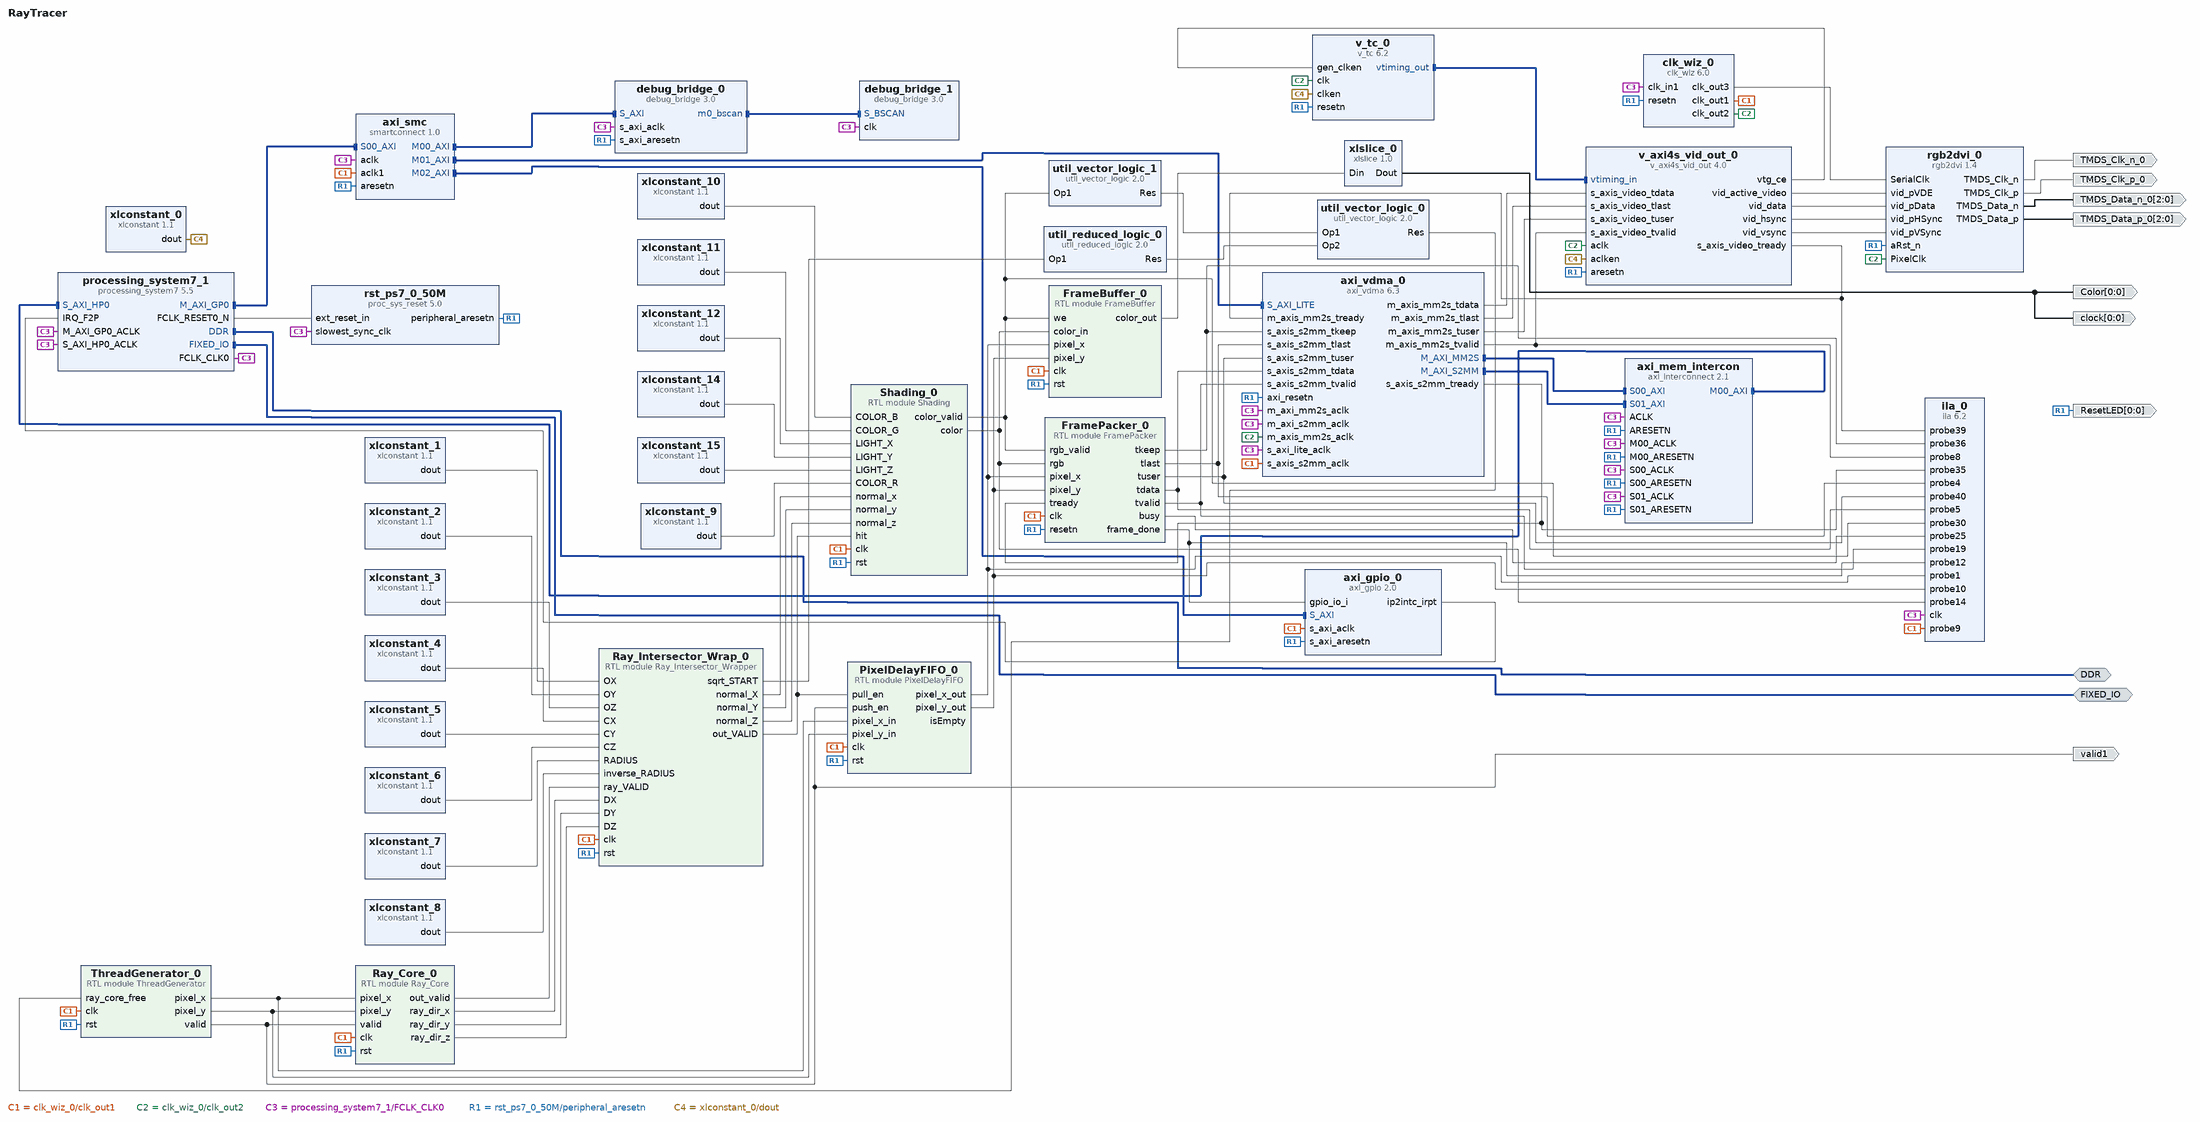
[diagram p0: block diagram of the top level]
# Vivado block design RayTracer, xc7z020clg400-1, Vivado 2024.2
create_bd_design RayTracer

create_bd_intf_port -mode Master -vlnv xilinx.com:interface:ddrx_rtl:1.0 DDR
create_bd_intf_port -mode Master -vlnv xilinx.com:display_processing_system7:fixedio_rtl:1.0 FIXED_IO
create_bd_port -dir O -from 0 -to 0 -type data Color
create_bd_port -dir O -from 0 -to 0 -type rst ResetLED
create_bd_port -dir O -type clk TMDS_Clk_n_0
create_bd_port -dir O -type clk TMDS_Clk_p_0
create_bd_port -dir O -from 2 -to 0 TMDS_Data_n_0
create_bd_port -dir O -from 2 -to 0 TMDS_Data_p_0
create_bd_port -dir O -from 0 -to 0 -type clk clock
create_bd_port -dir O valid1

create_bd_cell -type module -reference FrameBuffer FrameBuffer_0
create_bd_cell -type module -reference PixelDelayFIFO PixelDelayFIFO_0
create_bd_cell -type module -reference Ray_Core Ray_Core_0
create_bd_cell -type module -reference Ray_Intersector_Wrapper Ray_Intersector_Wrap_0
create_bd_cell -type module -reference Shading Shading_0
create_bd_cell -type module -reference ThreadGenerator ThreadGenerator_0
create_bd_cell -type ip -vlnv xilinx.com:ip:axi_interconnect:2.1 axi_mem_intercon
set_property -dict {CONFIG.NUM_MI 1 CONFIG.NUM_SI 2} [get_bd_cells axi_mem_intercon]
create_bd_cell -type ip -vlnv xilinx.com:ip:smartconnect:1.0 axi_smc
set_property -dict {CONFIG.NUM_CLKS 2 CONFIG.NUM_MI 3 CONFIG.NUM_SI 1} [get_bd_cells axi_smc]
create_bd_cell -type ip -vlnv xilinx.com:ip:axi_vdma:6.3 axi_vdma_0
set_property -dict {CONFIG.c_addr_width 32 CONFIG.c_num_fstores 1 CONFIG.c_use_mm2s_fsync 0} [get_bd_cells axi_vdma_0]
create_bd_cell -type ip -vlnv xilinx.com:ip:clk_wiz:6.0 clk_wiz_0
set_property -dict [list \
  CONFIG.CLKIN1_JITTER_PS 80.0 \
  CONFIG.CLKIN2_JITTER_PS 100.0 \
  CONFIG.CLKOUT1_JITTER 324.139 \
  CONFIG.CLKOUT1_PHASE_ERROR 251.929 \
  CONFIG.CLKOUT1_REQUESTED_OUT_FREQ 25.000 \
  CONFIG.CLKOUT2_JITTER 323.721 \
  CONFIG.CLKOUT2_PHASE_ERROR 251.929 \
  CONFIG.CLKOUT2_REQUESTED_OUT_FREQ 25.175 \
  CONFIG.CLKOUT2_USED true \
  CONFIG.CLKOUT3_JITTER 231.295 \
  CONFIG.CLKOUT3_PHASE_ERROR 251.929 \
  CONFIG.CLKOUT3_REQUESTED_OUT_FREQ 125.875 \
  CONFIG.CLKOUT3_USED true \
  CONFIG.CLK_IN1_BOARD_INTERFACE sys_clock \
  CONFIG.MMCM_CLKFBOUT_MULT_F 35.250 \
  CONFIG.MMCM_CLKIN1_PERIOD 8.000 \
  CONFIG.MMCM_CLKIN2_PERIOD 10.000 \
  CONFIG.MMCM_CLKOUT0_DIVIDE_F 35.250 \
  CONFIG.MMCM_CLKOUT1_DIVIDE 35 \
  CONFIG.MMCM_CLKOUT2_DIVIDE 7 \
  CONFIG.MMCM_DIVCLK_DIVIDE 5 \
  CONFIG.NUM_OUT_CLKS 3 \
  CONFIG.RESET_PORT resetn \
  CONFIG.RESET_TYPE ACTIVE_LOW \
  CONFIG.SECONDARY_SOURCE Single_ended_clock_capable_pin \
  CONFIG.USE_INCLK_SWITCHOVER false \
] [get_bd_cells clk_wiz_0]
create_bd_cell -type ip -vlnv xilinx.com:ip:debug_bridge:3.0 debug_bridge_0
set_property -dict {CONFIG.C_DEBUG_MODE 2 CONFIG.C_NUM_BS_MASTER 1} [get_bd_cells debug_bridge_0]
create_bd_cell -type ip -vlnv xilinx.com:ip:debug_bridge:3.0 debug_bridge_1
set_property -dict {CONFIG.C_ENABLE_CLK_DIVIDER false CONFIG.C_NUM_BS_MASTER 0} [get_bd_cells debug_bridge_1]
create_bd_cell -type ip -vlnv xilinx.com:ip:ila:6.2 ila_0
create_bd_cell -type ip -vlnv xilinx.com:ip:processing_system7:5.5 processing_system7_1
set_property -dict [list \
  CONFIG.PCW_APU_PERIPHERAL_FREQMHZ 666.666666 \
  CONFIG.PCW_ENET0_PERIPHERAL_ENABLE 0 \
  CONFIG.PCW_FPGA0_PERIPHERAL_FREQMHZ 50 \
  CONFIG.PCW_FPGA1_PERIPHERAL_FREQMHZ 50 \
  CONFIG.PCW_GPIO_MIO_GPIO_ENABLE 0 \
  CONFIG.PCW_IRQ_F2P_INTR 1 \
  CONFIG.PCW_PERIPHERAL_BOARD_PRESET part0 \
  CONFIG.PCW_PRESET_BANK1_VOLTAGE {LVCMOS 3.3V} \
  CONFIG.PCW_QSPI_PERIPHERAL_ENABLE 0 \
  CONFIG.PCW_SD0_PERIPHERAL_ENABLE 0 \
  CONFIG.PCW_UART1_PERIPHERAL_ENABLE 0 \
  CONFIG.PCW_UIPARAM_DDR_FREQ_MHZ 533.333333 \
  CONFIG.PCW_UIPARAM_DDR_PARTNO {MT41J128M8 JP-125} \
  CONFIG.PCW_USB0_PERIPHERAL_ENABLE 0 \
  CONFIG.PCW_USE_FABRIC_INTERRUPT 1 \
  CONFIG.PCW_USE_S_AXI_HP0 1 \
] [get_bd_cells processing_system7_1]
# 329 more settings of processing_system7_1 are not shown: defaults, MIO pin electricals, DDR timing, and values the tool derives
create_bd_cell -type ip -vlnv xilinx.com:ip:proc_sys_reset:5.0 rst_ps7_0_50M
create_bd_cell -type ip -vlnv xilinx.com:ip:util_reduced_logic:2.0 util_reduced_logic_0
set_property -dict {CONFIG.C_SIZE 5} [get_bd_cells util_reduced_logic_0]
create_bd_cell -type ip -vlnv xilinx.com:ip:util_vector_logic:2.0 util_vector_logic_0
set_property -dict {CONFIG.C_SIZE 1} [get_bd_cells util_vector_logic_0]
create_bd_cell -type ip -vlnv xilinx.com:ip:util_vector_logic:2.0 util_vector_logic_1
set_property -dict {CONFIG.C_OPERATION not CONFIG.C_SIZE 1} [get_bd_cells util_vector_logic_1]
create_bd_cell -type ip -vlnv xilinx.com:ip:v_axi4s_vid_out:4.0 v_axi4s_vid_out_0
create_bd_cell -type ip -vlnv xilinx.com:ip:v_tc:6.2 v_tc_0
set_property -dict {CONFIG.HAS_AXI4_LITE false CONFIG.HAS_INTC_IF false} [get_bd_cells v_tc_0]
create_bd_cell -type ip -vlnv xilinx.com:ip:xlconstant:1.1 xlconstant_0
create_bd_cell -type ip -vlnv xilinx.com:ip:xlconstant:1.1 xlconstant_1
set_property -dict {CONFIG.CONST_VAL 0 CONFIG.CONST_WIDTH 32} [get_bd_cells xlconstant_1]
create_bd_cell -type ip -vlnv xilinx.com:ip:xlconstant:1.1 xlconstant_10
set_property -dict {CONFIG.CONST_VAL 240 CONFIG.CONST_WIDTH 8} [get_bd_cells xlconstant_10]
create_bd_cell -type ip -vlnv xilinx.com:ip:xlconstant:1.1 xlconstant_11
set_property -dict {CONFIG.CONST_VAL 146 CONFIG.CONST_WIDTH 8} [get_bd_cells xlconstant_11]
create_bd_cell -type ip -vlnv xilinx.com:ip:xlconstant:1.1 xlconstant_12
set_property -dict {CONFIG.CONST_VAL 8192 CONFIG.CONST_WIDTH 32} [get_bd_cells xlconstant_12]
create_bd_cell -type ip -vlnv xilinx.com:ip:xlconstant:1.1 xlconstant_14
set_property -dict {CONFIG.CONST_VAL 8192 CONFIG.CONST_WIDTH 32} [get_bd_cells xlconstant_14]
create_bd_cell -type ip -vlnv xilinx.com:ip:xlconstant:1.1 xlconstant_15
set_property -dict {CONFIG.CONST_VAL 8192 CONFIG.CONST_WIDTH 32} [get_bd_cells xlconstant_15]
create_bd_cell -type ip -vlnv xilinx.com:ip:xlconstant:1.1 xlconstant_2
set_property -dict {CONFIG.CONST_VAL 0 CONFIG.CONST_WIDTH 32} [get_bd_cells xlconstant_2]
create_bd_cell -type ip -vlnv xilinx.com:ip:xlconstant:1.1 xlconstant_3
set_property -dict {CONFIG.CONST_VAL 0 CONFIG.CONST_WIDTH 32} [get_bd_cells xlconstant_3]
create_bd_cell -type ip -vlnv xilinx.com:ip:xlconstant:1.1 xlconstant_4
set_property -dict {CONFIG.CONST_VAL 0 CONFIG.CONST_WIDTH 32} [get_bd_cells xlconstant_4]
create_bd_cell -type ip -vlnv xilinx.com:ip:xlconstant:1.1 xlconstant_5
set_property -dict {CONFIG.CONST_VAL 0 CONFIG.CONST_WIDTH 32} [get_bd_cells xlconstant_5]
create_bd_cell -type ip -vlnv xilinx.com:ip:xlconstant:1.1 xlconstant_6
set_property -dict {CONFIG.CONST_VAL -1024 CONFIG.CONST_WIDTH 32} [get_bd_cells xlconstant_6]
create_bd_cell -type ip -vlnv xilinx.com:ip:xlconstant:1.1 xlconstant_7
set_property -dict {CONFIG.CONST_VAL 2048 CONFIG.CONST_WIDTH 31} [get_bd_cells xlconstant_7]
create_bd_cell -type ip -vlnv xilinx.com:ip:xlconstant:1.1 xlconstant_8
set_property -dict {CONFIG.CONST_VAL 131072 CONFIG.CONST_WIDTH 32} [get_bd_cells xlconstant_8]
create_bd_cell -type ip -vlnv xilinx.com:ip:xlconstant:1.1 xlconstant_9
set_property -dict {CONFIG.CONST_VAL 73 CONFIG.CONST_WIDTH 8} [get_bd_cells xlconstant_9]
create_bd_cell -type ip -vlnv xilinx.com:ip:xlslice:1.0 xlslice_0
set_property -dict {CONFIG.DIN_FROM 21 CONFIG.DIN_TO 21 CONFIG.DIN_WIDTH 24} [get_bd_cells xlslice_0]
create_bd_cell -type ip -vlnv xilinx.com:ip:axi_gpio:2.0 axi_gpio_0
set_property -dict [list \
  CONFIG.C_ALL_INPUTS 1 \
  CONFIG.C_GPIO_WIDTH 1 \
  CONFIG.C_INTERRUPT_PRESENT 1 \
  CONFIG.C_IS_DUAL 0 \
] [get_bd_cells axi_gpio_0]
create_bd_cell -type module -reference FramePacker FramePacker_0
create_bd_cell -type ip -vlnv digilentinc.com:ip:rgb2dvi:1.4 rgb2dvi_0
set_property -dict {CONFIG.kGenerateSerialClk false CONFIG.kRstActiveHigh false} [get_bd_cells rgb2dvi_0]

# ---- connections ----

connect_bd_intf_net [get_bd_intf_pins axi_mem_intercon/M00_AXI] [get_bd_intf_pins processing_system7_1/S_AXI_HP0]
connect_bd_intf_net [get_bd_intf_pins debug_bridge_0/S_AXI] [get_bd_intf_pins axi_smc/M00_AXI]
connect_bd_intf_net [get_bd_intf_pins axi_smc/M01_AXI] [get_bd_intf_pins axi_vdma_0/S_AXI_LITE]
connect_bd_intf_net [get_bd_intf_pins axi_smc/M02_AXI] [get_bd_intf_pins axi_gpio_0/S_AXI]
connect_bd_intf_net [get_bd_intf_pins axi_vdma_0/M_AXI_MM2S] [get_bd_intf_pins axi_mem_intercon/S00_AXI]
connect_bd_intf_net [get_bd_intf_pins axi_vdma_0/M_AXI_S2MM] [get_bd_intf_pins axi_mem_intercon/S01_AXI]
connect_bd_intf_net [get_bd_intf_pins debug_bridge_1/S_BSCAN] [get_bd_intf_pins debug_bridge_0/m0_bscan]
connect_bd_intf_net -intf_net processing_system7_0_M_AXI_GP0 [get_bd_intf_pins processing_system7_1/M_AXI_GP0] [get_bd_intf_pins axi_smc/S00_AXI]
connect_bd_intf_net [get_bd_intf_ports DDR] [get_bd_intf_pins processing_system7_1/DDR]
connect_bd_intf_net [get_bd_intf_ports FIXED_IO] [get_bd_intf_pins processing_system7_1/FIXED_IO]
connect_bd_intf_net [get_bd_intf_pins v_tc_0/vtiming_out] [get_bd_intf_pins v_axi4s_vid_out_0/vtiming_in]
connect_bd_net [get_bd_pins FrameBuffer_0/color_out] [get_bd_pins xlslice_0/Din]
connect_bd_net [get_bd_pins FramePacker_0/busy] [get_bd_pins ila_0/probe25]
connect_bd_net [get_bd_pins FramePacker_0/frame_done] [get_bd_pins axi_gpio_0/gpio_io_i] [get_bd_pins ila_0/probe12]
connect_bd_net [get_bd_pins FramePacker_0/tkeep] [get_bd_pins axi_vdma_0/s_axis_s2mm_tkeep] [get_bd_pins ila_0/probe36]
connect_bd_net [get_bd_pins FramePacker_0/tlast] [get_bd_pins axi_vdma_0/s_axis_s2mm_tlast] [get_bd_pins ila_0/probe4]
connect_bd_net [get_bd_pins FramePacker_0/tuser] [get_bd_pins axi_vdma_0/s_axis_s2mm_tuser] [get_bd_pins ila_0/probe40]
# net PixelDelayFIFO_0_isEmpty has one end: PixelDelayFIFO_0/isEmpty
connect_bd_net [get_bd_pins PixelDelayFIFO_0/pixel_x_out] \
  [get_bd_pins ila_0/probe1] [get_bd_pins FrameBuffer_0/pixel_x] [get_bd_pins FramePacker_0/pixel_x]
connect_bd_net [get_bd_pins PixelDelayFIFO_0/pixel_y_out] \
  [get_bd_pins ila_0/probe10] [get_bd_pins FrameBuffer_0/pixel_y] [get_bd_pins FramePacker_0/pixel_y]
connect_bd_net [get_bd_pins Ray_Core_0/out_valid] [get_bd_pins Ray_Intersector_Wrap_0/ray_VALID]
connect_bd_net [get_bd_pins Ray_Core_0/ray_dir_x] [get_bd_pins Ray_Intersector_Wrap_0/DX]
connect_bd_net [get_bd_pins Ray_Core_0/ray_dir_y] [get_bd_pins Ray_Intersector_Wrap_0/DY]
connect_bd_net [get_bd_pins Ray_Core_0/ray_dir_z] [get_bd_pins Ray_Intersector_Wrap_0/DZ]
connect_bd_net [get_bd_pins Ray_Intersector_Wrap_0/normal_X] [get_bd_pins Shading_0/normal_x]
connect_bd_net [get_bd_pins Ray_Intersector_Wrap_0/normal_Y] [get_bd_pins Shading_0/normal_y]
connect_bd_net [get_bd_pins Ray_Intersector_Wrap_0/normal_Z] [get_bd_pins Shading_0/normal_z]
connect_bd_net [get_bd_pins Ray_Intersector_Wrap_0/out_VALID] [get_bd_pins PixelDelayFIFO_0/pull_en] [get_bd_pins Shading_0/hit]
connect_bd_net [get_bd_pins Ray_Intersector_Wrap_0/sqrt_START] [get_bd_pins util_reduced_logic_0/Op1]
connect_bd_net [get_bd_pins Shading_0/color] [get_bd_pins ila_0/probe14] [get_bd_pins FrameBuffer_0/color_in] [get_bd_pins FramePacker_0/rgb]
connect_bd_net [get_bd_pins Shading_0/color_valid] \
  [get_bd_pins util_vector_logic_1/Op1] [get_bd_pins ila_0/probe30] [get_bd_pins FrameBuffer_0/we] \
  [get_bd_pins FramePacker_0/rgb_valid]
connect_bd_net [get_bd_pins ThreadGenerator_0/pixel_x] [get_bd_pins PixelDelayFIFO_0/pixel_x_in] [get_bd_pins Ray_Core_0/pixel_x]
connect_bd_net [get_bd_pins ThreadGenerator_0/pixel_y] [get_bd_pins PixelDelayFIFO_0/pixel_y_in] [get_bd_pins Ray_Core_0/pixel_y]
connect_bd_net [get_bd_pins ThreadGenerator_0/valid] [get_bd_ports valid1] [get_bd_pins PixelDelayFIFO_0/push_en] [get_bd_pins Ray_Core_0/valid]
connect_bd_net [get_bd_pins axi_gpio_0/ip2intc_irpt] [get_bd_pins processing_system7_1/IRQ_F2P]
connect_bd_net [get_bd_pins axi_vdma_0/m_axis_mm2s_tdata] [get_bd_pins v_axi4s_vid_out_0/s_axis_video_tdata]
connect_bd_net [get_bd_pins axi_vdma_0/m_axis_mm2s_tlast] [get_bd_pins v_axi4s_vid_out_0/s_axis_video_tlast]
connect_bd_net [get_bd_pins axi_vdma_0/m_axis_mm2s_tuser] [get_bd_pins v_axi4s_vid_out_0/s_axis_video_tuser]
connect_bd_net [get_bd_pins axi_vdma_0/m_axis_mm2s_tvalid] [get_bd_pins ila_0/probe8] [get_bd_pins v_axi4s_vid_out_0/s_axis_video_tvalid]
connect_bd_net [get_bd_pins axi_vdma_0/s_axis_s2mm_tready] [get_bd_pins ila_0/probe35] [get_bd_pins FramePacker_0/tready]
connect_bd_net [get_bd_pins clk_wiz_0/clk_out1] \
  [get_bd_pins ila_0/probe9] [get_bd_pins axi_vdma_0/s_axis_s2mm_aclk] [get_bd_pins axi_gpio_0/s_axi_aclk] \
  [get_bd_pins axi_smc/aclk1] [get_bd_pins FrameBuffer_0/clk] [get_bd_pins PixelDelayFIFO_0/clk] [get_bd_pins Ray_Core_0/clk] \
  [get_bd_pins Shading_0/clk] [get_bd_pins ThreadGenerator_0/clk] [get_bd_pins Ray_Intersector_Wrap_0/clk] \
  [get_bd_pins FramePacker_0/clk]
connect_bd_net [get_bd_pins clk_wiz_0/clk_out2] \
  [get_bd_pins v_tc_0/clk] [get_bd_pins v_axi4s_vid_out_0/aclk] [get_bd_pins axi_vdma_0/m_axis_mm2s_aclk] \
  [get_bd_pins rgb2dvi_0/PixelClk]
connect_bd_net [get_bd_pins clk_wiz_0/clk_out3] [get_bd_pins rgb2dvi_0/SerialClk]
connect_bd_net -net framPacker_0_tdata [get_bd_pins FramePacker_0/tdata] [get_bd_pins axi_vdma_0/s_axis_s2mm_tdata] [get_bd_pins ila_0/probe5]
connect_bd_net -net framPacker_0_tvalid [get_bd_pins FramePacker_0/tvalid] [get_bd_pins axi_vdma_0/s_axis_s2mm_tvalid] [get_bd_pins ila_0/probe19]
connect_bd_net -net processing_system7_0_FCLK_CLK1 [get_bd_pins processing_system7_1/FCLK_CLK0] \
  [get_bd_pins processing_system7_1/M_AXI_GP0_ACLK] [get_bd_pins axi_smc/aclk] [get_bd_pins rst_ps7_0_50M/slowest_sync_clk] \
  [get_bd_pins clk_wiz_0/clk_in1] [get_bd_pins ila_0/clk] [get_bd_pins debug_bridge_0/s_axi_aclk] \
  [get_bd_pins debug_bridge_1/clk] [get_bd_pins axi_vdma_0/s_axi_lite_aclk] [get_bd_pins axi_vdma_0/m_axi_mm2s_aclk] \
  [get_bd_pins axi_mem_intercon/S00_ACLK] [get_bd_pins processing_system7_1/S_AXI_HP0_ACLK] \
  [get_bd_pins axi_mem_intercon/M00_ACLK] [get_bd_pins axi_mem_intercon/ACLK] [get_bd_pins axi_vdma_0/m_axi_s2mm_aclk] \
  [get_bd_pins axi_mem_intercon/S01_ACLK]
connect_bd_net -net processing_system7_0_FCLK_RESET0_N1 [get_bd_pins processing_system7_1/FCLK_RESET0_N] [get_bd_pins rst_ps7_0_50M/ext_reset_in]
connect_bd_net [get_bd_pins rgb2dvi_0/TMDS_Clk_n] [get_bd_ports TMDS_Clk_n_0]
connect_bd_net [get_bd_pins rgb2dvi_0/TMDS_Clk_p] [get_bd_ports TMDS_Clk_p_0]
connect_bd_net [get_bd_pins rgb2dvi_0/TMDS_Data_n] [get_bd_ports TMDS_Data_n_0]
connect_bd_net [get_bd_pins rgb2dvi_0/TMDS_Data_p] [get_bd_ports TMDS_Data_p_0]
connect_bd_net [get_bd_pins rst_ps7_0_50M/peripheral_aresetn] \
  [get_bd_pins axi_smc/aresetn] [get_bd_pins debug_bridge_0/s_axi_aresetn] [get_bd_pins clk_wiz_0/resetn] \
  [get_bd_ports ResetLED] [get_bd_pins axi_vdma_0/axi_resetn] [get_bd_pins axi_mem_intercon/S00_ARESETN] \
  [get_bd_pins axi_mem_intercon/M00_ARESETN] [get_bd_pins axi_mem_intercon/ARESETN] \
  [get_bd_pins axi_mem_intercon/S01_ARESETN] [get_bd_pins v_axi4s_vid_out_0/aresetn] [get_bd_pins v_tc_0/resetn] \
  [get_bd_pins axi_gpio_0/s_axi_aresetn] [get_bd_pins FrameBuffer_0/rst] [get_bd_pins PixelDelayFIFO_0/rst] \
  [get_bd_pins Ray_Core_0/rst] [get_bd_pins Shading_0/rst] [get_bd_pins ThreadGenerator_0/rst] \
  [get_bd_pins Ray_Intersector_Wrap_0/rst] [get_bd_pins rgb2dvi_0/aRst_n] [get_bd_pins FramePacker_0/resetn]
connect_bd_net [get_bd_pins util_reduced_logic_0/Res] [get_bd_pins util_vector_logic_0/Op2]
connect_bd_net [get_bd_pins util_vector_logic_0/Res] [get_bd_pins ThreadGenerator_0/ray_core_free]
connect_bd_net [get_bd_pins util_vector_logic_1/Res] [get_bd_pins util_vector_logic_0/Op1]
connect_bd_net [get_bd_pins v_axi4s_vid_out_0/s_axis_video_tready] [get_bd_pins axi_vdma_0/m_axis_mm2s_tready] [get_bd_pins ila_0/probe39]
connect_bd_net [get_bd_pins v_axi4s_vid_out_0/vid_active_video] [get_bd_pins rgb2dvi_0/vid_pVDE]
connect_bd_net [get_bd_pins v_axi4s_vid_out_0/vid_data] [get_bd_pins rgb2dvi_0/vid_pData]
connect_bd_net [get_bd_pins v_axi4s_vid_out_0/vid_hsync] [get_bd_pins rgb2dvi_0/vid_pHSync]
connect_bd_net [get_bd_pins v_axi4s_vid_out_0/vid_vsync] [get_bd_pins rgb2dvi_0/vid_pVSync]
connect_bd_net [get_bd_pins v_axi4s_vid_out_0/vtg_ce] [get_bd_pins v_tc_0/gen_clken]
connect_bd_net [get_bd_pins xlconstant_0/dout] [get_bd_pins v_tc_0/clken] [get_bd_pins v_axi4s_vid_out_0/aclken]
connect_bd_net [get_bd_pins xlconstant_10/dout] [get_bd_pins Shading_0/COLOR_B]
connect_bd_net [get_bd_pins xlconstant_11/dout] [get_bd_pins Shading_0/COLOR_G]
connect_bd_net [get_bd_pins xlconstant_12/dout] [get_bd_pins Shading_0/LIGHT_X]
connect_bd_net [get_bd_pins xlconstant_14/dout] [get_bd_pins Shading_0/LIGHT_Y]
connect_bd_net [get_bd_pins xlconstant_15/dout] [get_bd_pins Shading_0/LIGHT_Z]
connect_bd_net [get_bd_pins xlconstant_1/dout] [get_bd_pins Ray_Intersector_Wrap_0/OX]
connect_bd_net [get_bd_pins xlconstant_2/dout] [get_bd_pins Ray_Intersector_Wrap_0/OY]
connect_bd_net [get_bd_pins xlconstant_3/dout] [get_bd_pins Ray_Intersector_Wrap_0/OZ]
connect_bd_net [get_bd_pins xlconstant_4/dout] [get_bd_pins Ray_Intersector_Wrap_0/CX]
connect_bd_net [get_bd_pins xlconstant_5/dout] [get_bd_pins Ray_Intersector_Wrap_0/CY]
connect_bd_net [get_bd_pins xlconstant_6/dout] [get_bd_pins Ray_Intersector_Wrap_0/CZ]
connect_bd_net [get_bd_pins xlconstant_7/dout] [get_bd_pins Ray_Intersector_Wrap_0/RADIUS]
connect_bd_net [get_bd_pins xlconstant_8/dout] [get_bd_pins Ray_Intersector_Wrap_0/inverse_RADIUS]
connect_bd_net [get_bd_pins xlconstant_9/dout] [get_bd_pins Shading_0/COLOR_R]
connect_bd_net [get_bd_pins xlslice_0/Dout] [get_bd_ports Color] [get_bd_ports clock]

# ---- address map ----
assign_bd_address -offset 0x00000000 -range 512M -target_address_space [get_bd_addr_spaces axi_vdma_0/Data_MM2S] [get_bd_addr_segs processing_system7_1/S_AXI_HP0/HP0_DDR_LOWOCM]
assign_bd_address -offset 0x00000000 -range 512M -target_address_space [get_bd_addr_spaces axi_vdma_0/Data_S2MM] [get_bd_addr_segs processing_system7_1/S_AXI_HP0/HP0_DDR_LOWOCM]
assign_bd_address -offset 0x41200000 -range 64K -target_address_space [get_bd_addr_spaces processing_system7_1/Data] [get_bd_addr_segs axi_gpio_0/S_AXI/Reg]
assign_bd_address -offset 0x43000000 -range 64K -target_address_space [get_bd_addr_spaces processing_system7_1/Data] [get_bd_addr_segs axi_vdma_0/S_AXI_LITE/Reg]
assign_bd_address -offset 0x43C00000 -range 64K -target_address_space [get_bd_addr_spaces processing_system7_1/Data] [get_bd_addr_segs debug_bridge_0/S_AXI/Reg0]

validate_bd_design
save_bd_design
